# Altium schematic sheet Logic_Inverter.SchDoc
size A4; Organization: TESLA Motors, INC; Address1: 3500 Deer Creek Road; Address2: Palo Alto, CA; Address4: U.S.A.; SheetNumber: 6; SheetTotal: 8
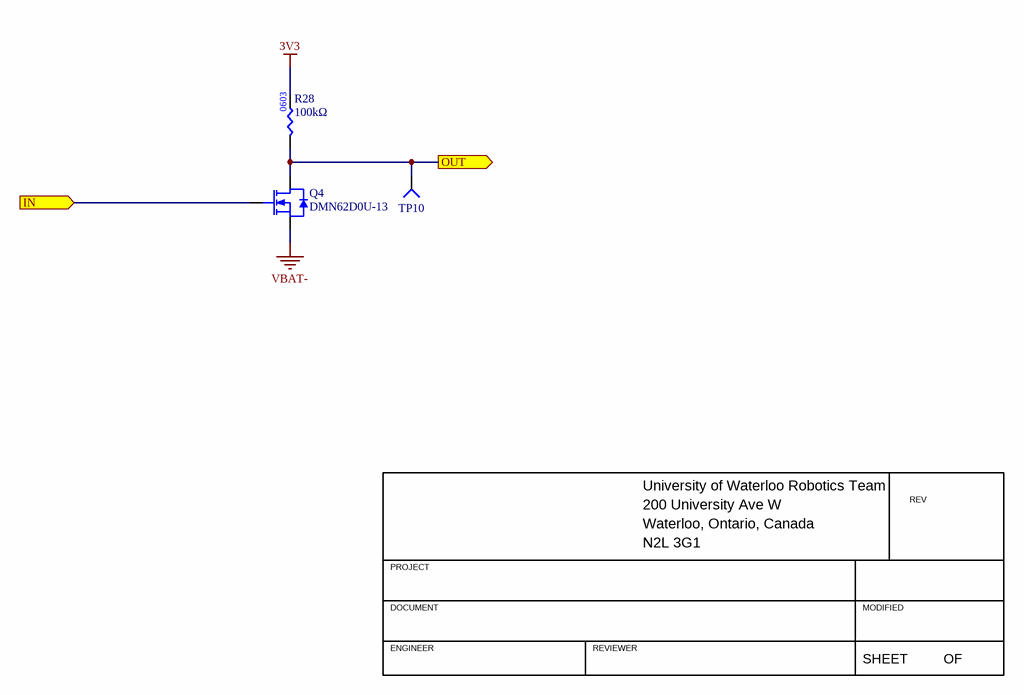
[diagram p0: Logic_Inverter.SchDoc]

## Parts
Q4  Manufacturer Part Number 1: DMN62D0U-13  [NMOS_SSOT-3]  (hidden comment: NMOS_60V_380mA)
R28  value 100kΩ  [RES0603]  (hidden comment: RES_100kΩ_0603_1%)
TP10  TESTPOINT_1MM_CIRCLE  [TESTPOINT_CIRCLE_1MM]  (value not drawn)  (no BOM)

## Ports
IN (in), OUT (out)

## Nets
3V3: R28.2
VBAT-: Q4.2(SOURCE)
IN: Q4.1(GATE) ; port IN
OUT: Q4.3(DRAIN) R28.1 TP10.1(=value) ; port OUT

## Notes on the sheet
- University of Waterloo Robotics Team
- 200 University Ave W
- REV
- PROJECT
- Waterloo, Ontario, Canada
- N2L 3G1
- DOCUMENT
- ENGINEER
- REVIEWER
- MODIFIED
- SHEET
- OF
- (in symbol RES_100kΩ_0603_1%) 0603

## Library data of the parts
Q4 = NMOS_60V_380mA: MOSFET N-CH 60V 380MA SOT23; Manufacturer 1: Diodes Incorporated; Vgs (Max): ±12V; Supplier 1: Digi-Key; Mounting Type: SMD; Package: SOT-23-3; Supplier Part Number 1: DMN62D0U-13DICT-ND; Id: 380mA; Vdss: 60V
R28 = RES_100kΩ_0603_1%: RES 100K OHM 1% 1/10W 0603; Manufacturer 1: Yageo; Manufacturer Part Number 1: RC0603FR-07100KL; Supplier Part Number 1: 311-100KHRCT-ND; Supplier 1: Digi-Key
TP10 = TESTPOINT_1MM_CIRCLE: TESTPOINT 1MM CIRCLE